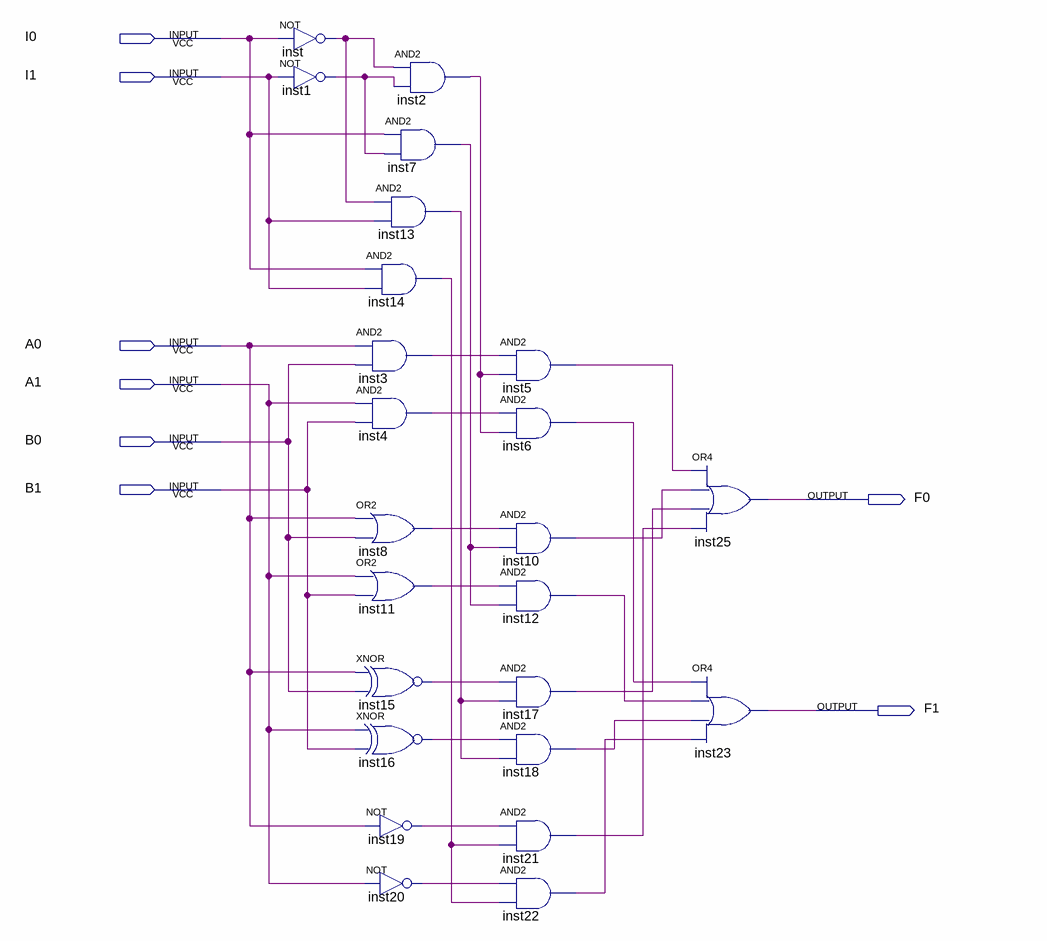
[diagram p0: schematic sheet]
// Quartus schematic Block1.bdf as structural Verilog: 24 symbols, 8 pins
module Block1 (
  input  I0,
  input  I1,
  input  A0,
  input  A1,
  input  B0,
  input  B1,
  output F0,
  output F1
);

  wire inst1_out, inst2_out, inst3_out, inst4_out, inst5_out, inst6_out, inst7_out, inst8_out, inst10_out,
       inst11_out, inst12_out, inst13_out, inst14_out, inst15_out, inst16_out, inst17_out, inst18_out,
       inst19_out, inst20_out, inst21_out, inst22_out, inst_out;

  not inst (inst_out, I0);
  not inst1 (inst1_out, I1);
  and inst2 (inst2_out, inst_out, inst1_out);
  and inst7 (inst7_out, I0, inst1_out);
  and inst13 (inst13_out, inst_out, I1);
  and inst14 (inst14_out, I0, I1);
  and inst3 (inst3_out, A0, B0);
  and inst4 (inst4_out, A1, B1);
  or inst8 (inst8_out, A0, B0);
  or inst11 (inst11_out, A1, B1);
  xnor inst15 (inst15_out, A0, B0);
  xnor inst16 (inst16_out, A1, B1);
  not inst19 (inst19_out, A0);
  not inst20 (inst20_out, A1);
  and inst5 (inst5_out, inst3_out, inst2_out);
  and inst6 (inst6_out, inst4_out, inst2_out);
  and inst10 (inst10_out, inst8_out, inst7_out);
  and inst12 (inst12_out, inst11_out, inst7_out);
  and inst17 (inst17_out, inst15_out, inst13_out);
  and inst18 (inst18_out, inst16_out, inst13_out);
  and inst21 (inst21_out, inst19_out, inst14_out);
  and inst22 (inst22_out, inst20_out, inst14_out);
  or inst25 (F0, inst5_out, inst10_out, inst17_out, inst21_out);
  or inst23 (F1, inst6_out, inst12_out, inst18_out, inst22_out);
endmodule
